# EasyEDA Pro project 测试用途.eprj, board PCB3_1
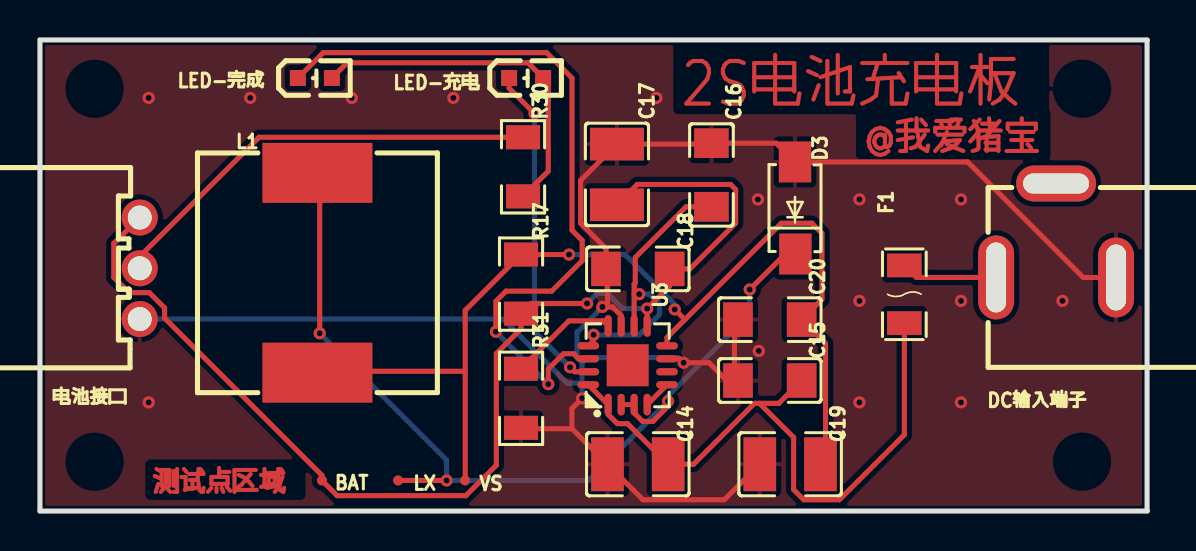
[diagram p11: board, top side]
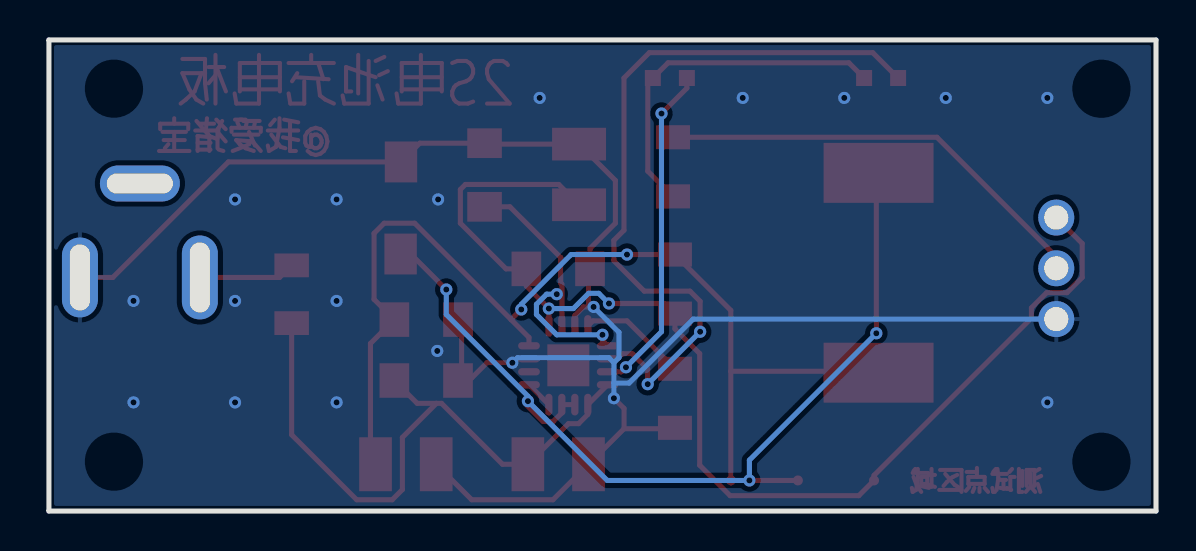
[diagram p12: board, bottom side, seen from below]

Outline 55.39 x 23.58 mm; copper layers: Top Layer, Bottom Layer. Coordinates in mm from the lower left corner of the outline.
Outline path: 0,23.58 55.39,23.58 55.39,0 0,0 0,23.58
Stack: Top Layer 0.035mm / Dielectric1 1.51mm FR4 er 4.5 / Bottom Layer 0.035mm

## Design rules (mm)
template: JLCPCB Capability(Two Layers Board)
spacing copperThickness1oz (default): track to track 0.102, other pairs 0.152 to 0.3
spacing copperThickness2oz: track to track 0.203, other pairs 0.152 to 0.3
track width copperThickness1oz (default): min 0.127, default 0.254, max 2.54
track width copperThickness2oz: min 0.203, default 0.254, max 2.54
differential pair differentialPair (default): width min 0.127, default 0.254, max 2.54; gap min 0.152, default 0.152
via viaSize (default): diameter min 0.5, default 0.61, max 10; hole min 0.3, default 0.305, max 6.3

## Placement (name value [footprint] x y rotation side)
BAT  -  [Test-Point-0.5mm]  14.11 1.53 180 top
C14  10UF  [C1210]  29.91 2.34 180 top
C15  100nf  [C1206]  36.51 6.53 0 top
C16  10UF  [C1206]  33.59 16.82 270 top
C17  10UF  [C1210]  28.87 16.85 90 top
C18  100nf  [C1206]  29.91 12.12 0 top
C19  10UF  [C1210]  37.53 2.34 180 top
C20  100nf  [C1206]  36.51 9.58 0 top
D3  SS14  [SMA_L4.3-W2.6-LS5.0-FD]  37.78 15.17 270 top
DC输入端子  DC-005-5A-2.0  [DC-IN-TH_DC-005-5A-2.0]  50.84 14.04 180 top
F1  SMD1206  [F1206]  43.25 10.85 90 top
L1  22uH  [IND-SMD_L12.0-W12.0_YPRH120X]  13.88 11.93 90 top
LED-充电  19-217/BHC-ZL1M2RY/3T  [LED0603-R-RD]  24.32 21.67 0 top
LED-完成  19-217/BHC-ZL1M2RY/3T  [LED0603-R-RD]  13.75 21.67 0 top
LX  -  [Test-Point-0.5mm]  17.92 1.53 90 top
R17  0.2Ω  [R1206]  24.07 11.36 90 top
R30  1KΩ  [R1206]  24.17 17.23 270 top
R31  50K  [R1206]  24.07 5.64 90 top
U3  TP5100  [TQFN-16_L4.0-W4.0-P0.65-BL-EP]  29.4 7.3 0 top
VS  -  [Test-Point-0.5mm]  21.27 1.53 270 top
电池接口  XH-3AW  [CONN-TH_3P-P2.54_HCTL_XH-3AW]  4.99 12.15 90 top

## Footprints (pads in the part's own frame, mm; a bottom-side part is the same pattern mirrored in y, then rotated)
C1206
  rect 1.485x1.728 smd: 1(-1.593,0) 2(1.593,0)
C1210
  rect 1.635x2.7 smd: 1(-1.518,0) 2(1.518,0)
CONN-TH_3P-P2.54_HCTL_XH-3AW
  round 1.8 hole 1.199: 1(-2.54,0) 2(0.002,0) 3(2.54,0)
DC-IN-TH_DC-005-5A-2.0
  oval 1.8x4.2 hole 1x3.5: 1(3,2.352)
  oval 1.8x4 hole 1x3.3: 2(-3,2.352)
  oval 4x1.8 hole 3.3x1: 3(-0.001,-2.352)
F1206
  rect 1.19x1.728 smd: 1(-1.445,0) 2(1.445,0)
IND-SMD_L12.0-W12.0_YPRH120X
  rect 3x5.5 smd: 1(-5,0) 2(5,0)
LED0603-R-RD
  rect 0.8x0.8 smd: 1(0.851,0) 2(-0.851,0)
R1206
  rect 1.208x1.701 smd: 1(-1.479,0) 2(1.479,0)
SMA_L4.3-W2.6-LS5.0-FD
  rect 2.046x1.62 smd: 1(-2.304,-0.009) 2(2.304,0.009)
Test-Point-0.5mm
  round 0.5 smd: 1(0,0)
TQFN-16_L4.0-W4.0-P0.65-BL-EP
  oval 0.364x1.087 smd: 1(-0.975,-1.968) 2(-0.325,-1.968) 3(0.325,-1.968) 4(0.975,-1.968) 9(0.975,1.968) 10(0.325,1.968) 11(-0.325,1.968) 12(-0.975,1.968)
  oval 1.087x0.364 smd: 5(1.968,-0.975) 6(1.968,-0.325) 7(1.968,0.325) 8(1.968,0.975) 13(-1.968,0.975) 14(-1.968,0.325) 15(-1.968,-0.325) 16(-1.968,-0.975)
  rect 2.1x2.1 smd: 17(0,0)

## Nets
GND: C14.2 C15.1 C16.1 C17.2 C18.1 C19.2 C20.1 D3.1 DC输入端子.2 R31.1 U3.7 U3.11 电池接口.1
VCC: C14.1 C15.2 F1.1 U3.1 U3.16
V-BAT-1S: R30.1 电池接口.2
V-BAT-2S: BAT.1 C17.1 C18.2 R17.1 U3.9 电池接口.3
VOUT: U3.4 U3.5
$1N690: LED-充电.2 U3.15
$1N694: D3.2 L1.2 LX.1 U3.2 U3.3
$1N699: C16.2 U3.10 U3.13
$1N702: C19.1 C20.2 L1.1 R17.2 U3.8 VS.1
$1N706: LED-完成.2 U3.14
$1N708: LED-充电.1 LED-完成.1 R30.2
$1N712: R31.2 U3.12
$1N1690: DC输入端子.1 F1.2

Pads without a net: DC输入端子 3; U3 6 17

## Via types
v1: diameter 0.61, hole 0.305, Top Layer to Bottom Layer, 33 vias

## Routing (per net, layer and track width the routed paths; a pad name or vN(x,y) marks a point on that pad's centre or on a via; arc(x,y) is an arc through that point)
GND: length 95.7
  Top Layer w0.254: v1(28.14,10.22) 28.39,10.22 ; 28.39,10.22 28.39,12.05 C18.1 28.32,13.14 27.05,14.41 27.05,16.55 C17.2 33.55,18.37 C16.1 36.84,18.41 D3.1 46.41,17.47 52.19,11.69 DC输入端子.2 ; 28.39,10.22 28.65,10.22 29.08,9.79 U3.11 ; 26.62,4.12 26.62,5.14 v1(27.12,5.64) ; 26.62,4.12 C14.2 30.17,0.56 34.24,0.56 C19.2 ; 26.62,4.12 24.11,4.12 R31.1 ; 34.74,6.66 C15.1 ; 34.74,6.66 34.24,6.66 33.47,7.42 v1(32.2,7.42) 32,7.62 U3.7 ; 34.74,6.66 34.74,9.4 C20.1
  Bottom Layer w0.254: 27.12,7.42 27.38,7.68 31.95,7.68 v1(32.2,7.42) ; 27.12,7.42 26.87,7.68 26.87,8.95 v1(28.14,10.22) ; 27.12,7.42 27.12,6.41 ; v1(27.12,5.64) 27.12,6.41 ; 27.12,6.41 26.36,6.41 23.16,9.61 电池接口.1
  vias: v1(5.44,20.68) v1(5.44,5.44) v1(10.52,20.68) v1(15.6,20.68) v1(20.68,20.68) v1(30.84,20.68) v1(35.92,15.6) v1(35.96,8.01) v1(41,15.6) v1(41,10.52) v1(41,5.44) v1(46.08,15.6) v1(46.08,10.52) v1(46.08,5.44) v1(51.16,10.52) v1(51.16,5.44)
VCC: length 32.1
  Top Layer w0.254: U3.16 U3.1 28.43,4.83 28.89,4.37 29.4,4.37 C14.1 32.7,2.34 35.75,5.39 36,5.39 ; C15.2 36.96,5.39 36,5.39 ; 36,5.39 37.71,3.69 37.71,1.07 38.21,0.56 39.99,0.56 43.25,3.82 F1.1
V-BAT-1S: length 22.2
  Top Layer w0.254: R30.1 10.96,18.71 4.99,12.74 电池接口.2
V-BAT-2S: length 59.1
  Top Layer w0.254: 电池接口.3 3.69,13.39 3.69,11.69 4.46,10.93 5.47,10.93 6.23,10.17 6.23,9.66 14.11,1.79 BAT.1 14.87,0.77 21.31,0.77 22.83,2.29 22.83,7.88 24.07,9.12 R17.1 24.58,10.39 v1(27.37,10.39) ; U3.9 v1(30.38,10.13) 31.5,11.26 C18.2 32.52,12.12 34.81,14.41 34.81,16.09 34.55,16.35 29.88,16.35 C17.1
  Bottom Layer w0.254: v1(27.37,10.39) 27.88,10.9 28.39,10.9 29.15,10.13 v1(30.38,10.13)
VOUT: length 1.4
  Top Layer w0.254: U3.4 U3.5
$1N690: length 16.7
  Top Layer w0.254: v1(24.74,19.9) 23.47,21.17 LED-充电.2 ; U3.15 26.75,6.97 v1(26.52,7.2)
  Bottom Layer w0.254: v1(24.74,19.9) 24.74,8.97 v1(26.52,7.2)
$1N694: length 47
  Top Layer w0.254: v1(20.34,1.53) LX.1 ; L1.2 13.99,16.81 v1(13.99,8.9) ; D3.2 37.29,12.87 v1(35.51,11.09) ; U3.2 U3.3 29.73,4.91 30.15,4.48 30.66,4.48 31.42,5.25 v1(31.42,5.5)
  Bottom Layer w0.254: v1(13.99,8.9) 20.34,2.55 v1(20.34,1.53) 27.46,1.53 v1(31.42,5.5) 31.42,5.75 35.51,9.84 v1(35.51,11.09)
$1N699: length 14.7
  Top Layer w0.254: 29.73,10.85 U3.10 ; 29.73,10.85 29.73,11.36 29.78,11.42 29.78,12.69 32.32,15.23 C16.2 ; 29.73,10.85 v1(29.98,10.85) ; U3.13 27.7,8.53 v1(27.7,8.82)
  Bottom Layer w0.254: v1(27.7,8.82) 29.98,8.82 31,9.84 31,10.35 30.49,10.85 v1(29.98,10.85)
$1N702: length 52.9
  Top Layer w0.254: C19.1 39.3,2.6 39.3,8.39 C20.2 39.12,10.6 39.12,13.9 38.62,14.41 37.09,14.41 32.27,9.58 ; 21.27,7 21.27,10.04 R17.2 v1(26.47,12.84) ; 21.27,7 13.95,7 L1.1 ; 21.27,7 21.27,1.54 ; 32.27,9.58 31.37,8.69 U3.8 ; 32.27,9.58 v1(31.76,10.09)
  Bottom Layer w0.254: v1(31.76,10.09) 31.76,10.34 29.26,12.84 v1(26.47,12.84)
$1N706: length 37.7
  Top Layer w0.254: v1(25.43,6.35) 25.43,7.11 26.19,7.87 26.7,7.87 26.96,7.62 U3.14 ; v1(22.81,8.97) 22.81,10.5 23.32,11.01 25.6,11.01 27.13,12.53 27.13,13.55 26.62,14.05 26.62,21.67 25.35,22.94 14.17,22.94 LED-完成.2
  Bottom Layer w0.254: v1(22.81,8.97) v1(25.43,6.35)
$1N708: length 17.8
  Top Layer w0.254: LED-完成.1 15.37,22.44 24.41,22.44 25.43,21.42 25.43,17.01 R30.2
$1N712: length 5.5
  Top Layer w0.254: R31.2 26.46,9.52 28.17,9.52 U3.12
$1N1690: length 4.8
  Top Layer w0.254: DC输入端子.1 43.85,11.69 F1.2

## Copper pours and planes (outline as drawn; the poured copper is in the pictures)
GND on Top Layer: 61.28,27.52 61.28,-5.15 -4.03,-5.15 -4.03,27.52
GND on Bottom Layer: 59.88,24.72 59.88,-3.37 -3.26,-3.37 -3.26,24.72

## Text on the board
Top Layer: @我爱猪宝 | 2S电池充电板 | 测试点区域
